# EAGLE design G007X (EAGLE 6.6.0)
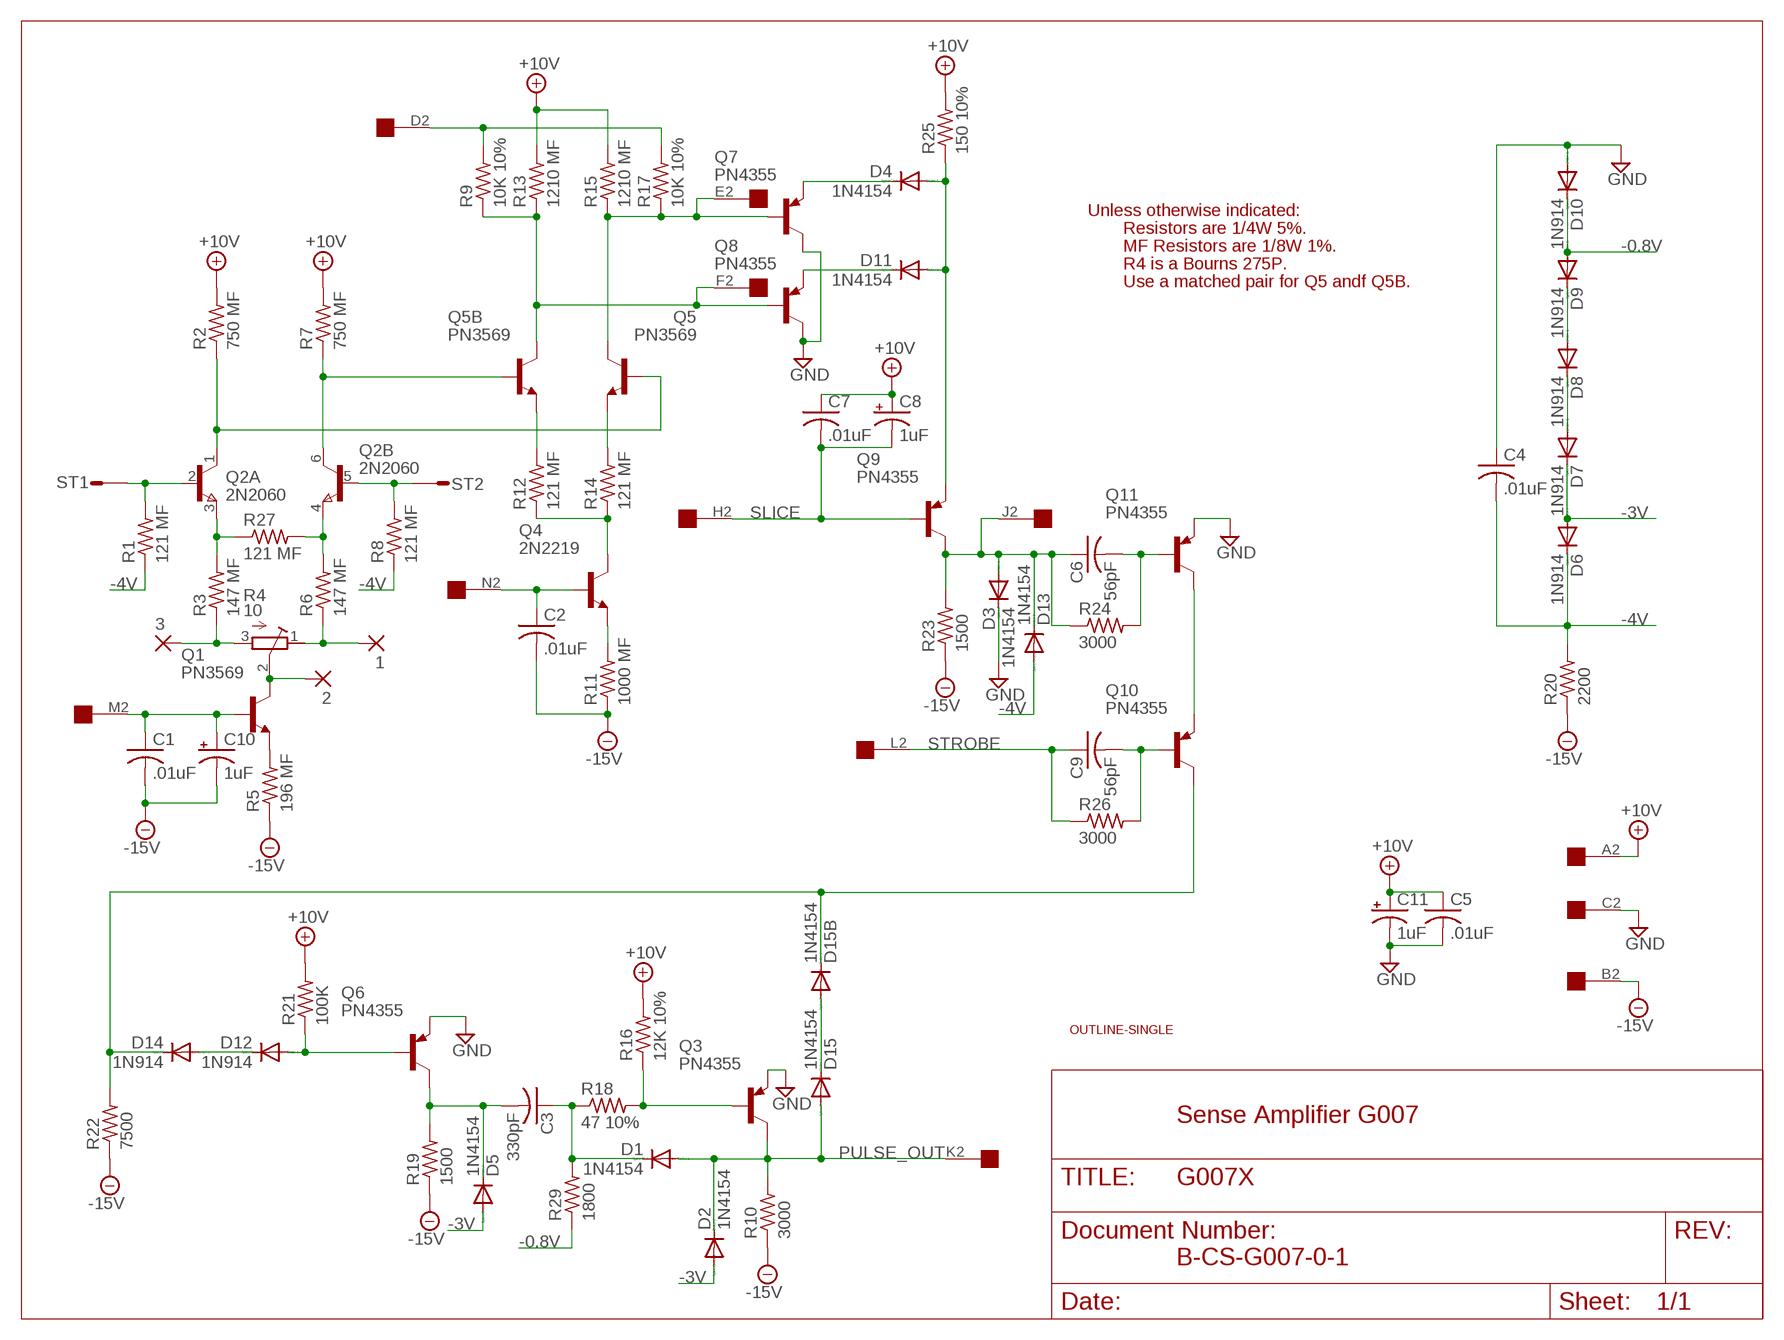
[diagram p0: schematic, sheet 1]

## Parts
1  2,54/0,8  [2,54/0,8]
2  2,54/0,8  [2,54/0,8]
3  2,54/0,8  [2,54/0,8]
C1  .01uF  C-US050-025X075  [C050-025X075]
C2  .01uF  C-US050-025X075  [C050-025X075]
C3  330pF  C-US075-032X103  [C075-032X103]
C4  .01uF  C-US050-025X075  [C050-025X075]
C5  .01uF  C-US050-025X075  [C050-025X075]
C6  56pF  C-US075-032X103  [C075-032X103]
C7  .01uF  C-US050-025X075  [C050-025X075]
C8  1uF  CPOL-USE12-4AXIAL  [E12-4]
C9  56pF  C-US075-032X103  [C075-032X103]
C10  1uF  CPOL-USE12-4AXIAL  [E12-4]
C11  1uF  CPOL-USE12-4AXIAL  [E12-4]
D1  1N4154  1N4148DO35-10  [DO35-10]
D2  1N4154  1N4148DO35-10  [DO35-10]
D3  1N4154  1N4148DO35-10  [DO35-10]
D4  1N4154  1N4148DO35-10  [DO35-10]
D5  1N4154  1N4148DO35-10  [DO35-10]
D6  1N914  1N4148DO35-10  [DO35-10]
D7  1N914  1N4148DO35-10  [DO35-10]
D8  1N914  1N4148DO35-10  [DO35-10]
D9  1N914  1N4148DO35-10  [DO35-10]
D10  1N914  1N4148DO35-10  [DO35-10]
D11  1N4154  1N4148DO35-10  [DO35-10]
D12  1N914  1N4148DO35-10  [DO35-10]
D13  1N4154  1N4148DO35-10  [DO35-10]
D14  1N914  1N4148DO35-10  [DO35-10]
D15  1N4154  1N4148DO35-10  [DO35-10]
D15B  1N4154  1N4148DO35-10  [DO35-10]
Q1  PN3569  2N2102  [TO5]
Q2  2N2060  MAT-02H  [TO78]
Q3  PN4355  2N2904  [TO39]
Q4  2N2219  2N2102  [TO5]
Q5  PN3569  2N2102  [TO5]
Q5B  PN3569  2N2102  [TO5]
Q6  PN4355  2N2904  [TO39]
Q7  PN4355  2N2904  [TO39]
Q8  PN4355  2N2904  [TO39]
Q9  PN4355  2N2904  [TO39]
Q10  PN4355  2N2904  [TO39]
Q11  PN4355  2N2904  [TO39]
R1  121 MF  R-US_0207/12  [0207/12]
R2  750 MF  R-US_0207/12  [0207/12]
R3  147 MF  R-US_0207/12  [0207/12]
R4  10  275P  [3006Y]
R5  196 MF  R-US_0207/12  [0207/12]
R6  147 MF  R-US_0207/12  [0207/12]
R7  750 MF  R-US_0207/12  [0207/12]
R8  121 MF  R-US_0207/12  [0207/12]
R9  10K 10%  R-US_0207/10  [0207/10]
R10  3000  R-US_0207/10  [0207/10]
R11  1000 MF  R-US_0207/12  [0207/12]
R12  121 MF  R-US_0207/12  [0207/12]
R13  1210 MF  R-US_0207/12  [0207/12]
R14  121 MF  R-US_0207/12  [0207/12]
R15  1210 MF  R-US_0207/12  [0207/12]
R16  12K 10%  R-US_0207/10  [0207/10]
R17  10K 10%  R-US_0207/10  [0207/10]
R18  47 10%  R-US_0207/10  [0207/10]
R19  1500  R-US_0207/10  [0207/10]
R20  2200  R-US_0207/10  [0207/10]
R21  100K  R-US_0207/10  [0207/10]
R22  7500  R-US_0207/10  [0207/10]
R23  1500  R-US_0207/10  [0207/10]
R24  3000  R-US_0207/10  [0207/10]
R25  150 10%  R-US_0207/10  [0207/10]
R26  3000  R-US_0207/10  [0207/10]
R27  121 MF  R-US_0207/12  [0207/12]
R29  1800  R-US_0207/10  [0207/10]
ST1  ST2,8  [ST2,8]
ST2  ST2,8  [ST2,8]
U$1  OUTLINE-SINGLE  [SINGLE]
U$2  EDGE-1  [EDGE-CON1]

## Nets
+10V: C5.1 C7.1 C8.+ C11.+ R2.2 R7.2 R13.2 R15.2 R16.2 R21.2 R25.2 U$2.A2
-0.8V: D9.A D10.C R29.1
-3V: D2.A D5.A D6.A D7.C
-4V: C4.2 D6.C D13.A R1.1 R8.1 R20.2
-15V: C1.2 C2.2 C10.- R5.1 R10.1 R11.1 R19.1 R20.1 R22.1 R23.1 U$2.B2
GND [Supply]: C4.1 C5.2 C11.- D3.C D10.A Q3.1(E) Q6.1(E) Q7.3(C) Q8.3(C) Q11.1(E) U$2.C2
N$1: D4.C Q7.1(E)
N$2: C6.1 D3.A D13.C Q9.3(C) R23.2 R24.1 U$2.J2
N$3: D11.C Q8.1(E)
N$4: Q4.3(C) R12.1 R14.1
N$5: C2.1 Q4.2(B) U$2.N2
N$6: D4.A D11.A Q9.1(E) R25.1
N$7: Q5B.1(E) R12.2
N$8: Q5B.3(C) Q8.2(B) R9.1 R13.1 U$2.F2
N$9: Q5.1(E) R14.2
N$10: Q2.1(A:C) Q5.2(B) R2.1
N$11: Q10.1(E) Q11.3(C)
N$12: C1.1 C10.+ Q1.2(B) U$2.M2
N$13: D14.C D15B.C Q10.3(C) R22.2
N$14 [Supply]: D8.A D9.C
N$15: R9.2 R17.2 U$2.D2
N$16: C9.2 Q10.2(B) R26.2
N$17: Q4.1(E) R11.2
N$18: D15.C D15B.A
N$20: D12.C D14.A
N$21: Q5.3(C) Q7.2(B) R15.1 R17.1 U$2.E2
N$22: C6.2 Q11.2(B) R24.2
N$23: D12.A Q6.2(B) R21.1
N$24: C3.2 D5.C Q6.3(C) R19.2
N$25: Q3.2(B) R16.1 R18.2
N$26: C3.1 D1.C R18.1 R29.2
N$27: D7.A D8.C
N$33: Q2.6(B:C) Q5B.2(B) R7.1
N$34: Q2.2(A:B) R1.2 ST1.1(ST)
N$35: Q2.5(B:B) R8.2 ST2.1(ST)
N$36: Q2.3(A:E) R3.2 R27.1
N$37: Q2.4(B:E) R6.2 R27.2
N$38: 3.1(P) R3.1 R4.3(E)
N$39: 1.1(P) R4.1(A) R6.1
N$40: 2.1(P) Q1.3(C) R4.2(S)
N$43: Q1.1(E) R5.2
PULSE_OUT: D1.A D2.C D15.A Q3.3(C) R10.2 U$2.K2
SLICE: C7.2 C8.- Q9.2(B) U$2.H2
STROBE: C9.1 R26.1 U$2.L2
Unconnected: U$2.P2 U$2.R2 U$2.S2 U$2.T2 U$2.U2 U$2.V2

## Notes on the sheet
- Unless otherwise indicated:
- Resistors are 1/4W 5%.
- MF Resistors are 1/8W 1%.
- R4 is a Bourns 275P.
- Use a matched pair for Q5 andf Q5B.
- Sense Amplifier G007
- B-CS-G007-0-1

## Library data of the parts
1-3 = wirepad:2,54/0,8: THROUGH-HOLE PAD
C1-C7 C9 = rcl:C-US: CAPACITOR, American symbol
C8 C10 C11 = dec-con:CPOL-USE12-4AXIAL: 0.5" veresion of an electrolytic
D1-D15 D15B = diode:1N4148: DIODE high speed (Philips)
Q1 Q4 Q5 Q5B = transistor:2N2102: NPN TRANSISTOR
Q2 = linear:MAT-02H: Dual TRANSISTOR
Q3 Q6-Q11 = transistor-pnp:2N2904*: PNP Transistror
R1-R3 R5-R27 R29 = rcl:R-US_: RESISTOR, American symbol
R4 = dec-con:275P: Trimpot with 275P (3006Y) footprint.
ST1 ST2 = con-rib:ST2,8: RIBBON CABLE CONNECTOR Flachstecker / Faston; OC_FARNELL: unknown; OC_NEWARK: unknown
U$1 = dec-con:OUTLINE-*: Board outlines for DEC boards.
U$2 = dec-con:EDGE-1: Single-Sided DEC Edge Connector -- (side 2)

## Net classes
1 Supply: width 0.813 mm

## Board
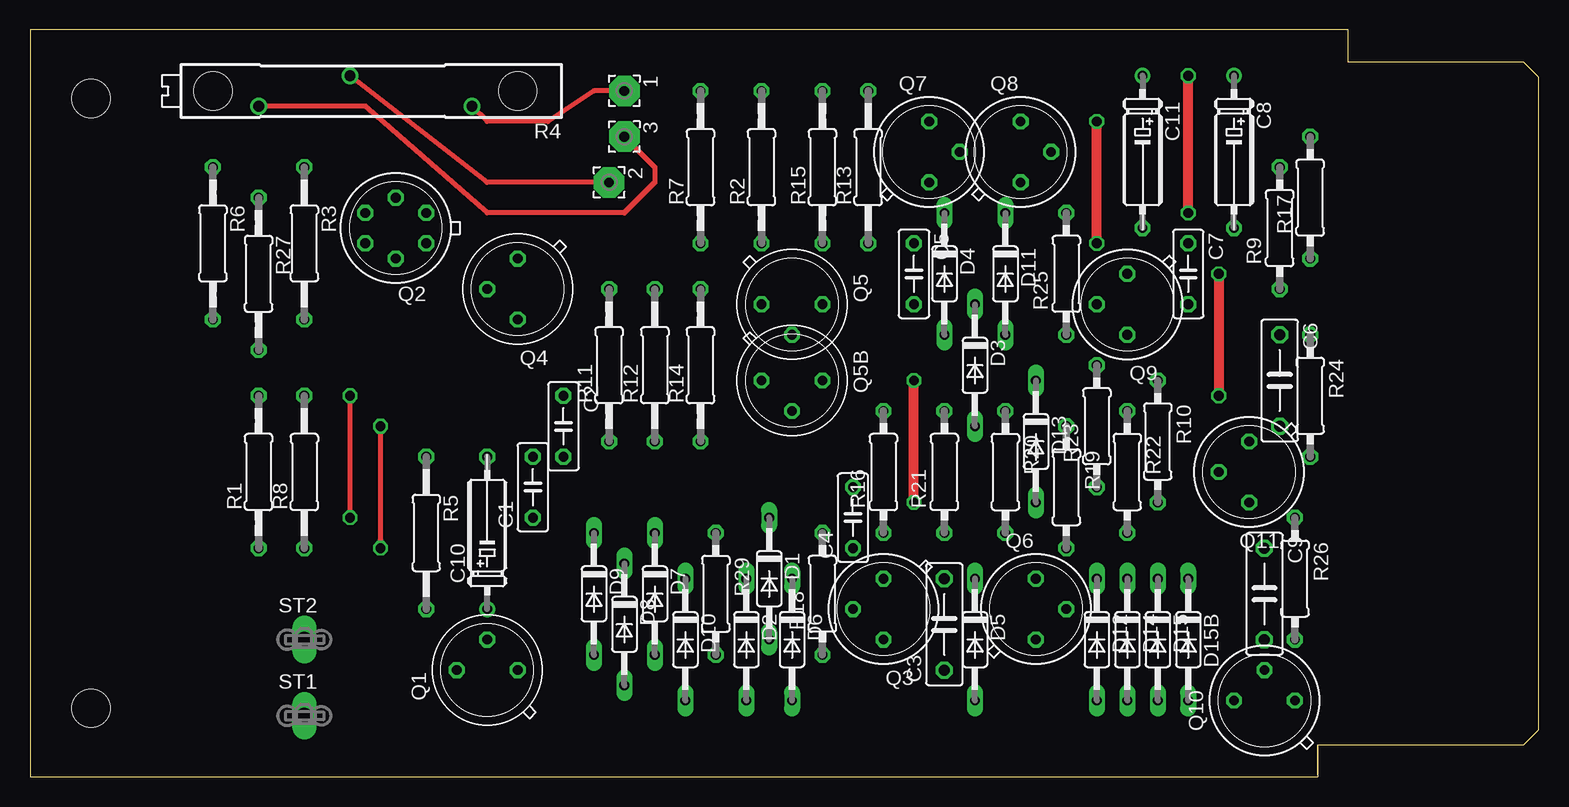
[diagram p1: board, top side]
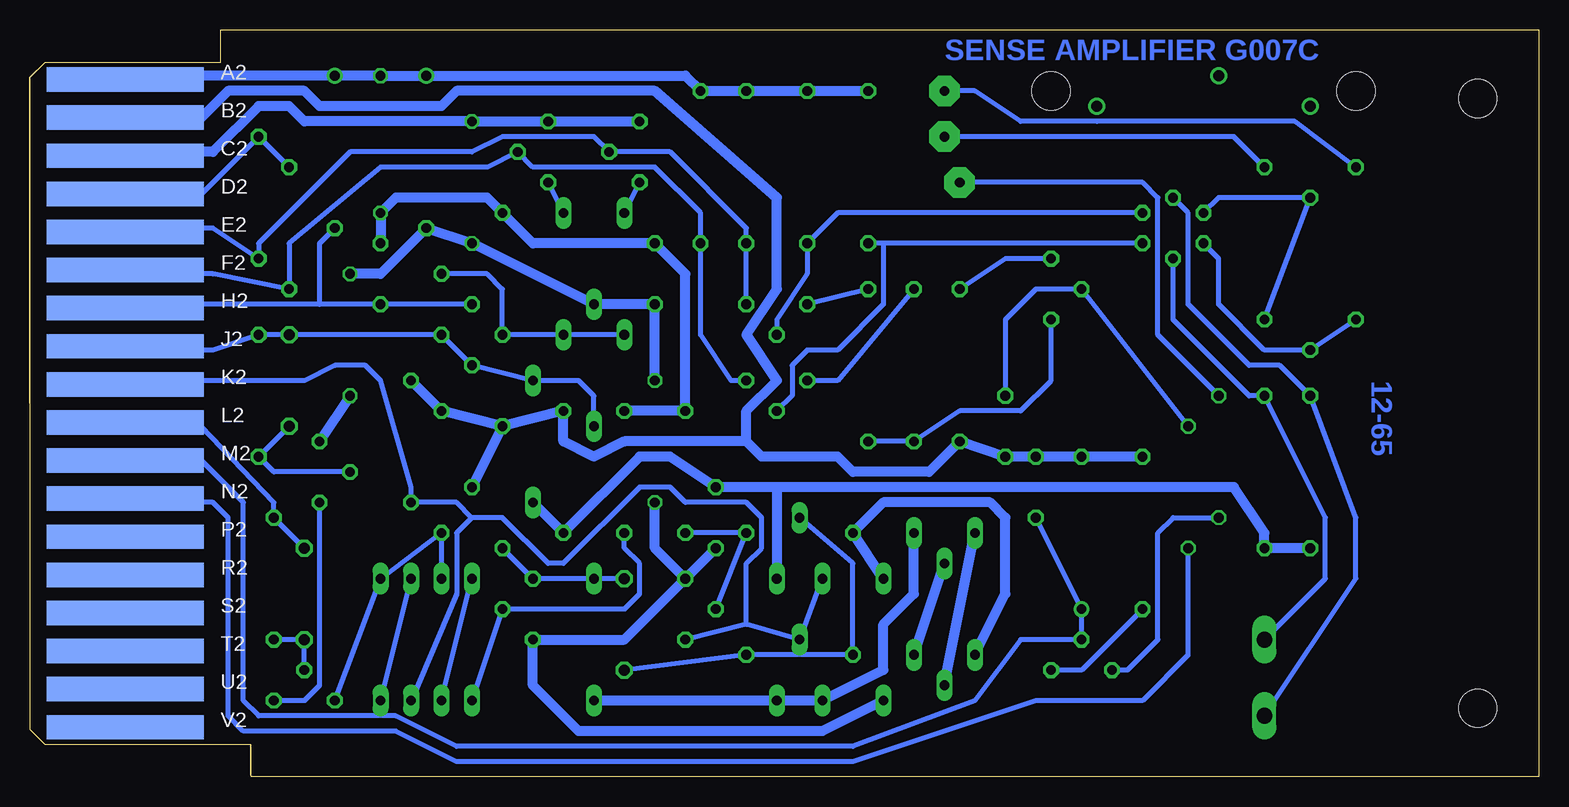
[diagram p2: board, bottom side, seen from below]

Size 125.73 x 62.23 mm. Coordinates in mm from the lower left corner, seen from the top.
Copper layers (1+16): Top 0.035mm / dielectric 1.5mm / Bottom 0.035mm
Design rules "16mils": minimum track width 16mil, minimum drill 32mil, track to track 15mil, track to pad 10mil, pad to pad 10mil, via to via 10mil, smd to smd 10mil, copper to edge 13mil, drill to drill 10mil, minimum pad ring 10mil, minimum via ring 8mil, stop-mask expansion 0mil, vias tented up to drill 0mil, thermal gap 10mil
Holes 3.17 mm at 15.24,57.15 40.64,57.15

### Footprints (pad centres in the part's own frame; a part is rotated, then mirrored left to right if it is on the bottom)
2,54/0,8 = drill 0.813 pad 2.54 octagon: 1 0,0
C050-025X075 = drill 0.813 octagon: 1 -2.54,0; 2 2.54,0
C075-032X103 = drill 0.914 octagon: 1 -3.81,0; 2 3.81,0
E12-4 = drill 0.813: + -7.62,0 | drill 0.813 octagon: - 5.08,0
DO35-10 = drill 0.813 long: A 5.08,0; C -5.08,0
TO5 = drill 0.813 octagon: 1 0,-2.54; 2 2.54,0; 3 0,2.54
TO78 = drill 0.813 octagon: 1 -2.54,-1.27; 2 0,-2.54; 3 2.54,-1.27; 4 2.54,1.27; 5 0,2.54; 6 -2.54,1.27
TO39 = drill 0.813 octagon: 1 0,-2.54; 2 2.54,0; 3 0,2.54
0207/12 = drill 0.813 octagon: 1 -6.35,0; 2 6.35,0
3006Y = drill 0.9: 1 -8.89,1.27; 2 1.27,-1.27; 3 8.89,1.27
0207/10 = drill 0.813 octagon: 1 -5.08,0; 2 5.08,0
ST2,8 = drill 1.321 long: 1 0,0
SINGLE = hole 3.175: 120.65,56.515; 120.65,5.715
EDGE-CON1 = smd 13.106 x 2.032 bottom: A2 7.938,4.128; B2 7.938,7.303; C2 7.938,10.477; D2 7.938,13.652; E2 7.938,16.828; F2 7.938,20.003; H2 7.938,23.177; J2 7.938,26.352; K2 7.938,29.527; L2 7.938,32.703; M2 7.938,35.877; N2 7.938,39.053; P2 7.938,42.227; R2 7.938,45.403; S2 7.938,48.578; T2 7.938,51.752; U2 7.938,54.928; V2 7.938,58.102

### Placement (x,y rotation side)
1  49.53,57.15 270 top
2  48.26,49.53 270 top
3  49.53,53.34 270 top
C1  41.91,24.13 90 top
C2  44.45,29.21 270 top
C3  76.2,12.7 90 top
C4  68.58,21.59 90 top
C5  73.66,41.91 270 top
C6  104.14,33.02 270 top
C7  96.52,41.91 270 top
C8  100.33,50.8 270 top
C9  102.87,15.24 270 top
C10  38.1,21.59 90 top
C11  92.71,50.8 270 top
D1  61.59,16.51 270 top
D2  59.69,11.43 270 top
D3  78.74,34.29 270 top
D4  76.2,41.91 270 top
D5  78.74,11.43 270 top
D6  63.5,11.43 270 top
D7  52.07,15.24 270 top
D8  49.53,12.7 270 top
D9  46.99,15.24 270 top
D10  54.61,11.43 270 top
D11  81.28,41.91 270 top
D12  88.9,11.43 270 top
D13  83.82,27.94 270 top
D14  91.44,11.43 270 top
D15  93.98,11.43 270 top
D15B  96.52,11.43 270 top
Q1  38.1,8.89 90 top
Q2  30.48,45.72 180 top
Q3  71.12,13.97 180 top
Q4  40.64,40.64 180 top
Q5  63.5,39.37 270 top
Q5B  63.5,33.02 270 top
Q6  83.82,13.97 0 top
Q7  74.93,52.07 0 top
Q8  82.55,52.07 0 top
Q9  91.44,39.37 180 top
Q10  102.87,6.35 90 top
Q11  101.6,25.4 180 top
R1  19.05,25.4 90 top
R2  60.96,50.8 90 top
R3  22.86,44.45 270 top
R4  27.94,57.15 180 top
R5  33.02,20.32 270 top
R6  15.24,44.45 270 top
R7  55.88,50.8 90 top
R8  22.86,25.4 90 top
R9  104.14,45.72 90 top
R10  93.98,27.94 270 top
R11  48.26,34.29 90 top
R12  52.07,34.29 90 top
R13  69.85,50.8 90 top
R14  55.88,34.29 90 top
R15  66.04,50.8 90 top
R16  71.12,25.4 90 top
R17  106.68,48.26 90 top
R18  66.04,15.24 90 top
R19  86.36,24.13 270 top
R20  81.28,25.4 270 top
R21  76.2,25.4 90 top
R22  91.44,25.4 270 top
R23  88.9,29.21 90 top
R24  106.68,31.75 270 top
R25  86.36,41.91 90 top
R26  105.41,16.51 270 top
R27  19.05,41.91 270 top
R29  57.15,15.24 270 top
ST1  22.86,5.08 0 top
ST2  22.86,11.43 0 top
U$1  125.73,62.23 180 top
U$2  125.73,62.23 180 top

### Tracks (layer width: path | path; a pad name or v marks a point on that pad's centre or on a via)
+10V  (via drill 0.81)
  Top 0.813: v96.52,46.99 v96.52,58.42
  Bottom 0.813: U$2.A2 117.22,58.04 116.84,58.42 C8.+ v96.52,58.42 C11.+ 71.12,58.42 R13.2 R15.2 R2.2 R7.2 | C7.1 v96.52,46.99 95.25,48.26 87.63,48.26 R25.2 83.82,44.45 C5.1 71.12,41.91 R16.2 R21.2
-0.8V
  Bottom 0.813: D10.C R29.1 54.61,22.86 45.72,22.86 44.45,21.59 44.45,15.24 D9.A
-3V
  Bottom 0.813: D7.C 52.07,15.24 54.61,12.7 54.61,8.89 D2.A D6.A D5.A
-4V
  Bottom 0.813: R1.1 R8.1 22.86,20.32 25.4,24.13 63.5,24.13 | 63.5,24.13 C4.2 72.39,26.67 74.93,26.67 R20.2 D13.A | 63.5,24.13 D6.C
-15V
  Bottom 0.813: U$2.B2 117.13,54.9 116.84,54.61 111.76,54.61 109.22,57.15 102.87,57.15 101.6,55.88 91.44,55.88 90.17,57.15 73.66,57.15 63.5,48.26 63.5,40.64 66.04,36.83 63.5,33.02 66.04,30.48 66.04,27.94 | R5.1 C10.- C1.2 C2.2 R11.1 50.8,25.4 57.15,25.4 58.42,26.67 64.77,26.67 66.04,27.94 | R19.1 R22.1 R10.1 | R19.1 R20.1 81.28,27.94 78.74,26.67 76.2,27.94 66.04,27.94 | R19.1 R23.1
GND  (via drill 0.81)
  Top 0.813: v99.06,41.91 v99.06,31.75 | v88.9,44.45 v88.9,54.61 | v73.66,22.86 v73.66,33.02
  Bottom 0.813: U$2.C2 117.17,51.74 116.84,52.07 110.49,52.07 106.68,55.88 104.14,55.88 102.87,54.61 v88.9,54.61 Q8.3 Q7.3 | v99.06,31.75 Q11.1 | Q3.1 C4.1 | Q3.1 76.2,11.43 Q6.1 83.82,7.62 80.01,3.81 59.69,3.81 D10.A | v99.06,41.91 96.52,41.91 C11.- v88.9,44.45 D3.C C5.2 v73.66,33.02 | Q3.1 73.66,19.05 v73.66,22.86
N$1
  Bottom 0.406: D4.C Q7.1
N$2
  Bottom 0.406: U$2.J2 117.17,35.89 116.84,35.56 110.49,35.56 R24.1 C6.1 Q9.3 R23.2 D13.C 80.01,33.02 78.74,31.75 D3.A
N$3
  Bottom 0.406: D11.C Q8.1
N$4
  Bottom 0.406: Q4.3 40.64,33.02 43.18,30.48 48.26,30.48 R12.1 R14.1
N$5  (via drill 0.81)
  Top 0.406: v29.21,19.05 v29.21,29.21
  Bottom 0.406: U$2.N2 117.17,23.19 116.84,22.86 110.49,22.86 109.22,21.59 109.22,5.08 107.95,3.81 95.25,3.81 90.17,1.27 57.15,1.27 41.91,6.35 33.02,6.35 29.21,10.16 v29.21,19.05 | v29.21,29.21 Q4.2 41.91,40.64 44.45,38.1 C2.1
N$6
  Bottom 0.406: D4.A D11.A R25.1 86.36,40.64 87.63,41.91 Q9.1
N$7
  Bottom 0.406: Q5B.1 58.42,33.02 R12.2
N$8
  Bottom 0.406: U$2.F2 117.12,42.19 116.84,41.91 110.49,41.91 R9.1 104.14,44.45 96.52,50.8 87.63,50.8 Q8.2 83.82,50.8 73.66,50.8 69.85,46.99 R13.1 69.85,36.83 67.31,33.02 Q5B.3
N$9
  Bottom 0.406: R14.2 Q5.1
N$10
  Bottom 0.406: Q5.2 63.5,38.1 60.96,41.91 R2.1 58.42,46.99 Q2.1
N$11
  Bottom 0.406: Q10.1 102.87,6.35 101.6,7.62 Q11.3
N$12
  Bottom 0.406: U$2.M2 115.9,26.34 115.57,26.67 111.76,26.67 107.95,22.86 107.95,6.35 106.68,5.08 95.25,5.08 90.17,2.54 57.15,2.54 46.99,6.35 43.18,11.43 Q1.2 C10.+ C1.1
N$13
  Bottom 0.406: R22.2 D14.C R22.2 | Q10.3 D15B.C R22.2
N$14
  Bottom 0.813: D8.A D9.C
N$15
  Bottom 0.406: U$2.D2 117.14,48.56 116.84,48.26 111.76,48.26 R17.2 R9.2
N$16
  Bottom 0.406: R26.2 C9.2 Q10.2
N$17
  Bottom 0.406: Q4.1 44.45,43.18 R11.2
N$18
  Bottom 0.406: D15B.A D15.C
N$20
  Bottom 0.406: D14.A D12.C
N$21
  Bottom 0.406: U$2.E2 117.17,45.39 116.84,45.72 110.49,45.72 R17.1 106.68,44.45 99.06,52.07 88.9,52.07 86.36,53.34 78.74,53.34 Q7.2 72.39,52.07 66.04,45.72 R15.1 Q5.3
N$22
  Bottom 0.406: Q11.2 105.41,25.4 R24.2 C6.2
N$23
  Bottom 0.406: D12.A Q6.2 76.2,13.97 74.93,15.24 74.93,17.78 76.2,19.05 R21.1
N$24
  Bottom 0.406: C3.2 D5.C Q6.3 R19.2
N$25
  Bottom 0.406: Q3.2 R18.2 R16.1
N$26
  Bottom 0.406: C3.1 R18.1 R29.2 57.15,17.78 D1.C
N$27
  Bottom 0.813: D7.A D8.C
N$33
  Bottom 0.406: 54.61,44.45 54.61,39.37 58.42,35.56 60.96,35.56 62.23,34.29 62.23,31.75 Q5B.2 | Q2.6 54.61,44.45 | 54.61,44.45 R7.1
N$34
  Bottom 0.406: ST1.1 15.24,16.51 15.24,21.59 R1.2 21.59,34.29 24.13,34.29 29.21,39.37 29.21,46.99 Q2.2
N$35
  Bottom 0.406: Q2.5 30.48,38.1 24.13,31.75 R8.2 17.78,21.59 17.78,16.51 ST2.1
N$36
  Bottom 0.406: Q2.3 26.67,48.26 R27.1 R3.2
N$37
  Bottom 0.406: R6.2 R27.2 22.86,35.56 26.67,39.37 26.67,43.18 Q2.4
N$38
  Top 0.406: R4.3 27.94,55.88 38.1,46.99 49.53,46.99 52.07,49.53 52.07,50.8 3.1
  Bottom 0.406: R3.1 25.4,53.34 3.1
N$39
  Top 0.406: R4.1 38.1,54.61 43.18,54.61 46.99,57.15 1.1
  Bottom 0.406: 1.1 46.99,57.15 43.18,54.61 36.83,54.61 20.32,54.61 R6.1
N$40  (via drill 0.81)
  Top 0.406: v26.67,21.59 v26.67,31.75 | R4.2 38.1,49.53 2.1
  Bottom 0.406: Q1.3 34.29,8.89 31.75,11.43 31.75,20.32 30.48,21.59 v26.67,21.59 | v26.67,31.75 31.75,36.83 31.75,48.26 33.02,49.53 2.1
N$43
  Bottom 0.406: Q1.1 38.1,8.89 R5.2
PULSE_OUT
  Bottom 0.406: 88.9,21.59 90.17,22.86 R10.2 93.98,24.13 96.52,33.02 97.79,34.29 100.33,34.29 102.87,33.02 116.84,33.02 U$2.K2 | 88.9,21.59 86.36,21.59 82.55,17.78 81.28,17.78 74.93,24.13 72.39,24.13 71.12,22.86 66.04,22.86 64.77,21.59 64.77,19.05 66.04,17.78 66.04,12.7 | 66.04,12.7 Q3.3 | 66.04,12.7 D1.A D2.C | D15.A 90.17,15.24 90.17,20.32 88.9,21.59
SLICE
  Bottom 0.406: U$2.H2 117.17,39.04 116.84,39.37 101.6,39.37 | Q9.2 C7.2 101.6,39.37 | C8.- 101.6,44.45 101.6,39.37
STROBE
  Bottom 0.406: C9.1 R26.1 105.41,22.86 111.44,29.21 116.84,29.21 117.17,29.54 U$2.L2

### Text on the board
Bottom: SENSE AMPLIFIER G007C | 12-65